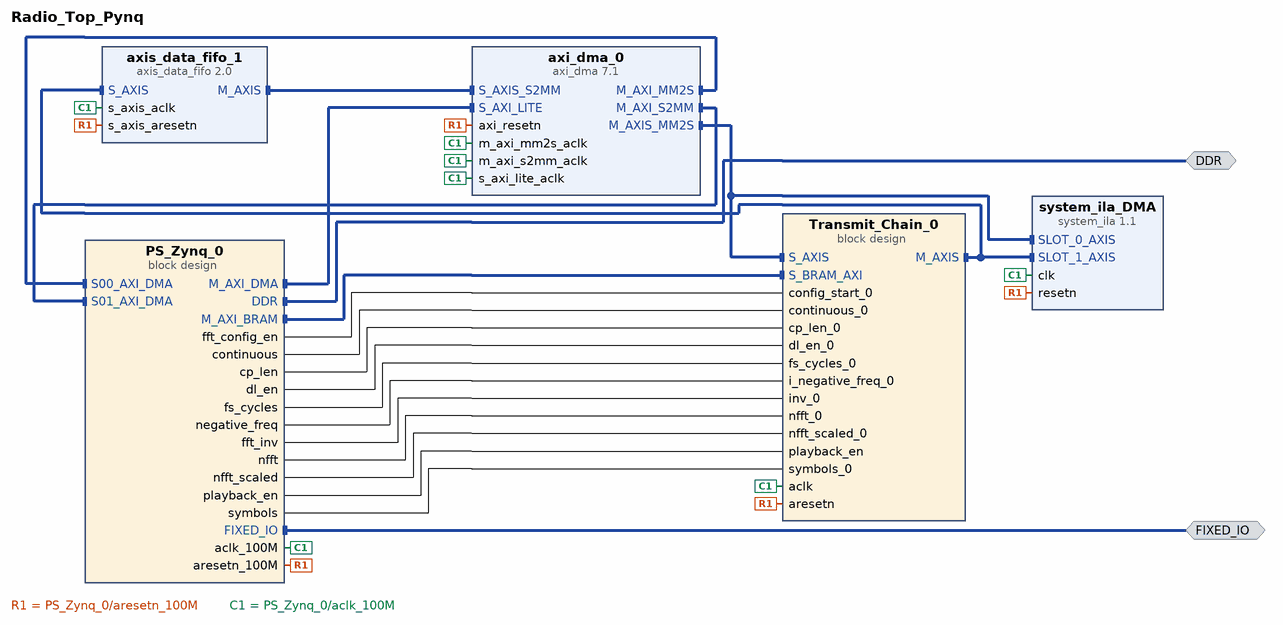
[diagram p0: block diagram of the top level]
# Vivado block design Radio_Top_Pynq, xc7z020clg400-1, Vivado 2022.1
create_bd_design Radio_Top_Pynq

create_bd_intf_port -mode Master -vlnv xilinx.com:interface:ddrx_rtl:1.0 DDR
create_bd_intf_port -mode Master -vlnv xilinx.com:display_processing_system7:fixedio_rtl:1.0 FIXED_IO

create_bd_cell -type container -reference Transmit_Chain Transmit_Chain_0
set_property -dict [list \
  CONFIG.ACTIVE_SIM_BD Transmit_Chain.bd \
  CONFIG.ACTIVE_SYNTH_BD Transmit_Chain.bd \
  CONFIG.ENABLE_DFX 0 \
  CONFIG.LIST_SIM_BD Transmit_Chain.bd \
  CONFIG.LIST_SYNTH_BD Transmit_Chain.bd \
  CONFIG.LOCK_PROPAGATE 0 \
] [get_bd_cells Transmit_Chain_0]
create_bd_cell -type ip -vlnv xilinx.com:ip:axi_dma:7.1 axi_dma_0
set_property -dict [list \
  CONFIG.c_include_mm2s_dre 1 \
  CONFIG.c_include_s2mm_dre 1 \
  CONFIG.c_include_sg 0 \
  CONFIG.c_mm2s_burst_size 256 \
  CONFIG.c_s2mm_burst_size 256 \
  CONFIG.c_sg_length_width 26 \
] [get_bd_cells axi_dma_0]
create_bd_cell -type ip -vlnv xilinx.com:ip:axis_data_fifo:2.0 axis_data_fifo_1
set_property -dict {CONFIG.FIFO_DEPTH 8192} [get_bd_cells axis_data_fifo_1]
create_bd_cell -type ip -vlnv xilinx.com:ip:system_ila:1.1 system_ila_DMA
set_property -dict [list \
  CONFIG.C_DATA_DEPTH 2048 \
  CONFIG.C_NUM_MONITOR_SLOTS 2 \
  CONFIG.C_SLOT 1 \
  CONFIG.C_SLOT_0_INTF_TYPE xilinx.com:interface:axis_rtl:1.0 \
  CONFIG.C_SLOT_1_INTF_TYPE xilinx.com:interface:axis_rtl:1.0 \
] [get_bd_cells system_ila_DMA]
create_bd_cell -type container -reference PS_Zynq PS_Zynq_0
set_property -dict [list \
  CONFIG.ACTIVE_SIM_BD PS_Zynq.bd \
  CONFIG.ACTIVE_SYNTH_BD PS_Zynq.bd \
  CONFIG.ENABLE_DFX 0 \
  CONFIG.LIST_SIM_BD PS_Zynq.bd \
  CONFIG.LIST_SYNTH_BD PS_Zynq.bd \
  CONFIG.LOCK_PROPAGATE 0 \
] [get_bd_cells PS_Zynq_0]

# ---- connections ----

connect_bd_intf_net [get_bd_intf_ports DDR] [get_bd_intf_pins PS_Zynq_0/DDR]
connect_bd_intf_net [get_bd_intf_ports FIXED_IO] [get_bd_intf_pins PS_Zynq_0/FIXED_IO]
connect_bd_intf_net [get_bd_intf_pins PS_Zynq_0/M_AXI_BRAM] [get_bd_intf_pins Transmit_Chain_0/S_BRAM_AXI]
connect_bd_intf_net [get_bd_intf_pins PS_Zynq_0/M_AXI_DMA] [get_bd_intf_pins axi_dma_0/S_AXI_LITE]
connect_bd_intf_net [get_bd_intf_pins PS_Zynq_0/S00_AXI_DMA] [get_bd_intf_pins axi_dma_0/M_AXI_MM2S]
connect_bd_intf_net [get_bd_intf_pins PS_Zynq_0/S01_AXI_DMA] [get_bd_intf_pins axi_dma_0/M_AXI_S2MM]
connect_bd_intf_net -intf_net S_AXIS_1 [get_bd_intf_pins Transmit_Chain_0/S_AXIS] [get_bd_intf_pins axi_dma_0/M_AXIS_MM2S]
connect_bd_intf_net [get_bd_intf_pins Transmit_Chain_0/S_AXIS] [get_bd_intf_pins system_ila_DMA/SLOT_0_AXIS]
connect_bd_intf_net [get_bd_intf_pins Transmit_Chain_0/M_AXIS] [get_bd_intf_pins axis_data_fifo_1/S_AXIS]
connect_bd_intf_net [get_bd_intf_pins Transmit_Chain_0/M_AXIS] [get_bd_intf_pins system_ila_DMA/SLOT_1_AXIS]
connect_bd_intf_net [get_bd_intf_pins axi_dma_0/S_AXIS_S2MM] [get_bd_intf_pins axis_data_fifo_1/M_AXIS]
connect_bd_net -net ARESETN_1 [get_bd_pins PS_Zynq_0/aresetn_100M] \
  [get_bd_pins Transmit_Chain_0/aresetn] [get_bd_pins axi_dma_0/axi_resetn] [get_bd_pins axis_data_fifo_1/s_axis_aresetn] \
  [get_bd_pins system_ila_DMA/resetn]
connect_bd_net -net config_start_0_1 [get_bd_pins PS_Zynq_0/fft_config_en] [get_bd_pins Transmit_Chain_0/config_start_0]
connect_bd_net -net continuous_0_1 [get_bd_pins PS_Zynq_0/continuous] [get_bd_pins Transmit_Chain_0/continuous_0]
connect_bd_net -net cp_len_0_1 [get_bd_pins PS_Zynq_0/cp_len] [get_bd_pins Transmit_Chain_0/cp_len_0]
connect_bd_net -net dl_en_0_1 [get_bd_pins PS_Zynq_0/dl_en] [get_bd_pins Transmit_Chain_0/dl_en_0]
connect_bd_net -net fs_cycles_0_1 [get_bd_pins PS_Zynq_0/fs_cycles] [get_bd_pins Transmit_Chain_0/fs_cycles_0]
connect_bd_net -net i_negative_freq_0_1 [get_bd_pins PS_Zynq_0/negative_freq] [get_bd_pins Transmit_Chain_0/i_negative_freq_0]
connect_bd_net -net inv_0_1 [get_bd_pins PS_Zynq_0/fft_inv] [get_bd_pins Transmit_Chain_0/inv_0]
connect_bd_net -net nfft_0_1 [get_bd_pins PS_Zynq_0/nfft] [get_bd_pins Transmit_Chain_0/nfft_0]
connect_bd_net -net nfft_scaled_0_1 [get_bd_pins PS_Zynq_0/nfft_scaled] [get_bd_pins Transmit_Chain_0/nfft_scaled_0]
connect_bd_net -net playback_en_1 [get_bd_pins PS_Zynq_0/playback_en] [get_bd_pins Transmit_Chain_0/playback_en]
connect_bd_net -net processing_system7_0_FCLK_CLK0 [get_bd_pins PS_Zynq_0/aclk_100M] \
  [get_bd_pins Transmit_Chain_0/aclk] [get_bd_pins axi_dma_0/m_axi_mm2s_aclk] [get_bd_pins axi_dma_0/m_axi_s2mm_aclk] \
  [get_bd_pins axi_dma_0/s_axi_lite_aclk] [get_bd_pins axis_data_fifo_1/s_axis_aclk] [get_bd_pins system_ila_DMA/clk]
connect_bd_net -net symbols_0_1 [get_bd_pins PS_Zynq_0/symbols] [get_bd_pins Transmit_Chain_0/symbols_0]
set_property HDL_ATTRIBUTE.DEBUG true [get_bd_intf_nets S_AXIS_1]

# ---- address map ----
assign_bd_address -offset 0x00000000 -range 512M -target_address_space [get_bd_addr_spaces axi_dma_0/Data_MM2S] [get_bd_addr_segs PS_Zynq_0/processing_system7_0/S_AXI_HP0/HP0_DDR_LOWOCM]
assign_bd_address -offset 0x00000000 -range 512M -target_address_space [get_bd_addr_spaces axi_dma_0/Data_S2MM] [get_bd_addr_segs PS_Zynq_0/processing_system7_0/S_AXI_HP0/HP0_DDR_LOWOCM]
assign_bd_address -offset 0x40000000 -range 128 -target_address_space [get_bd_addr_spaces PS_Zynq_0/processing_system7_0/Data] [get_bd_addr_segs axi_dma_0/S_AXI_LITE/Reg]
assign_bd_address -offset 0x40010000 -range 128 -target_address_space [get_bd_addr_spaces PS_Zynq_0/processing_system7_0/Data] [get_bd_addr_segs PS_Zynq_0/gpio_regs/axi_gpio_0/S_AXI/Reg]
assign_bd_address -offset 0x40010100 -range 128 -target_address_space [get_bd_addr_spaces PS_Zynq_0/processing_system7_0/Data] [get_bd_addr_segs PS_Zynq_0/gpio_regs/axi_gpio_1/S_AXI/Reg]
assign_bd_address -offset 0x40010200 -range 128 -target_address_space [get_bd_addr_spaces PS_Zynq_0/processing_system7_0/Data] [get_bd_addr_segs PS_Zynq_0/gpio_regs/axi_gpio_2/S_AXI/Reg]
assign_bd_address -offset 0x40020000 -range 16K -target_address_space [get_bd_addr_spaces PS_Zynq_0/processing_system7_0/Data] [get_bd_addr_segs Transmit_Chain_0/axi_bram_ctrl_0/S_AXI/Mem0]

validate_bd_design
save_bd_design
